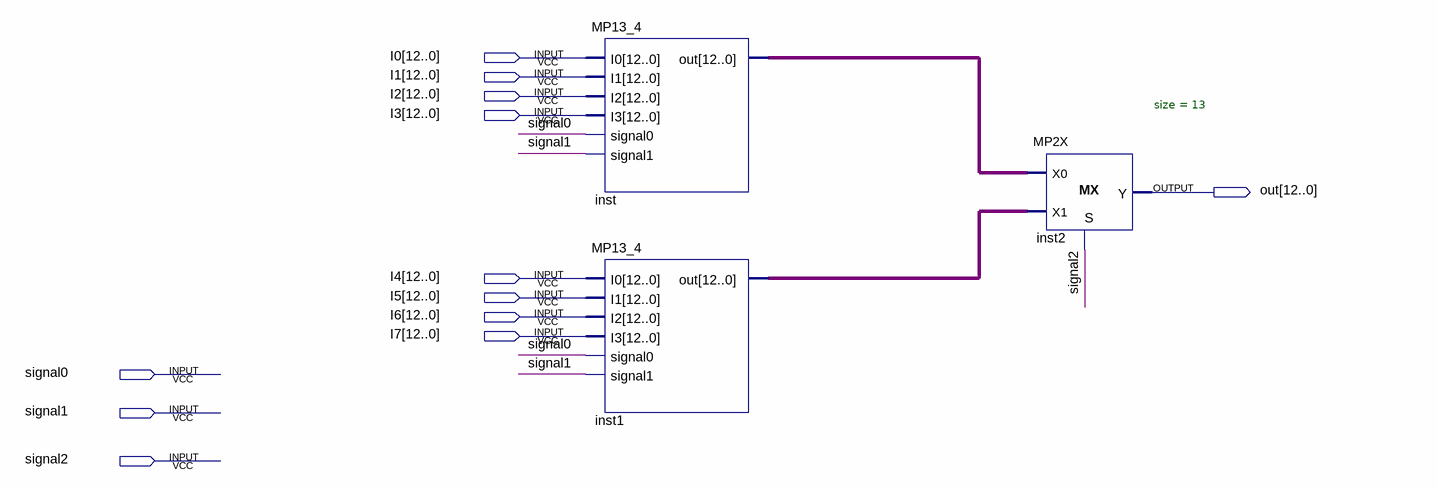
[diagram p0: schematic sheet]
// Quartus schematic MP13_8.bdf as structural Verilog: 3 symbols, 12 pins
module MP13_8 (
  input  [12:0] I0,
  input  [12:0] I1,
  input  [12:0] I2,
  input  [12:0] I3,
  input  [12:0] I4,
  input  [12:0] I5,
  input  [12:0] I6,
  input  [12:0] I7,
  input  signal0,
  input  signal1,
  input  signal2,
  output [12:0] out
);

  wire [12:0] inst1_out, inst_out;

  MP13_4 inst (.I0(I0), .I1(I1), .I2(I2), .I3(I3), .signal0(signal0), .signal1(signal1), .out(inst_out));
  MP13_4 inst1 (.I0(I4), .I1(I5), .I2(I6), .I3(I7), .signal0(signal0), .signal1(signal1), .out(inst1_out));
  MP2X #(.size(13)) inst2 (.S(signal2), .X0(inst_out), .X1(inst1_out), .Y(out));
endmodule
